# EasyEDA schematic Molten slime.json

## Sheets
1 Molten Slime all connected: TITLE: Molten Slime all connected; REV: 1.0; Date: 2025-02-14; Sheet: 1/1; Drawn By: tarasusthelight; Company: Your Company
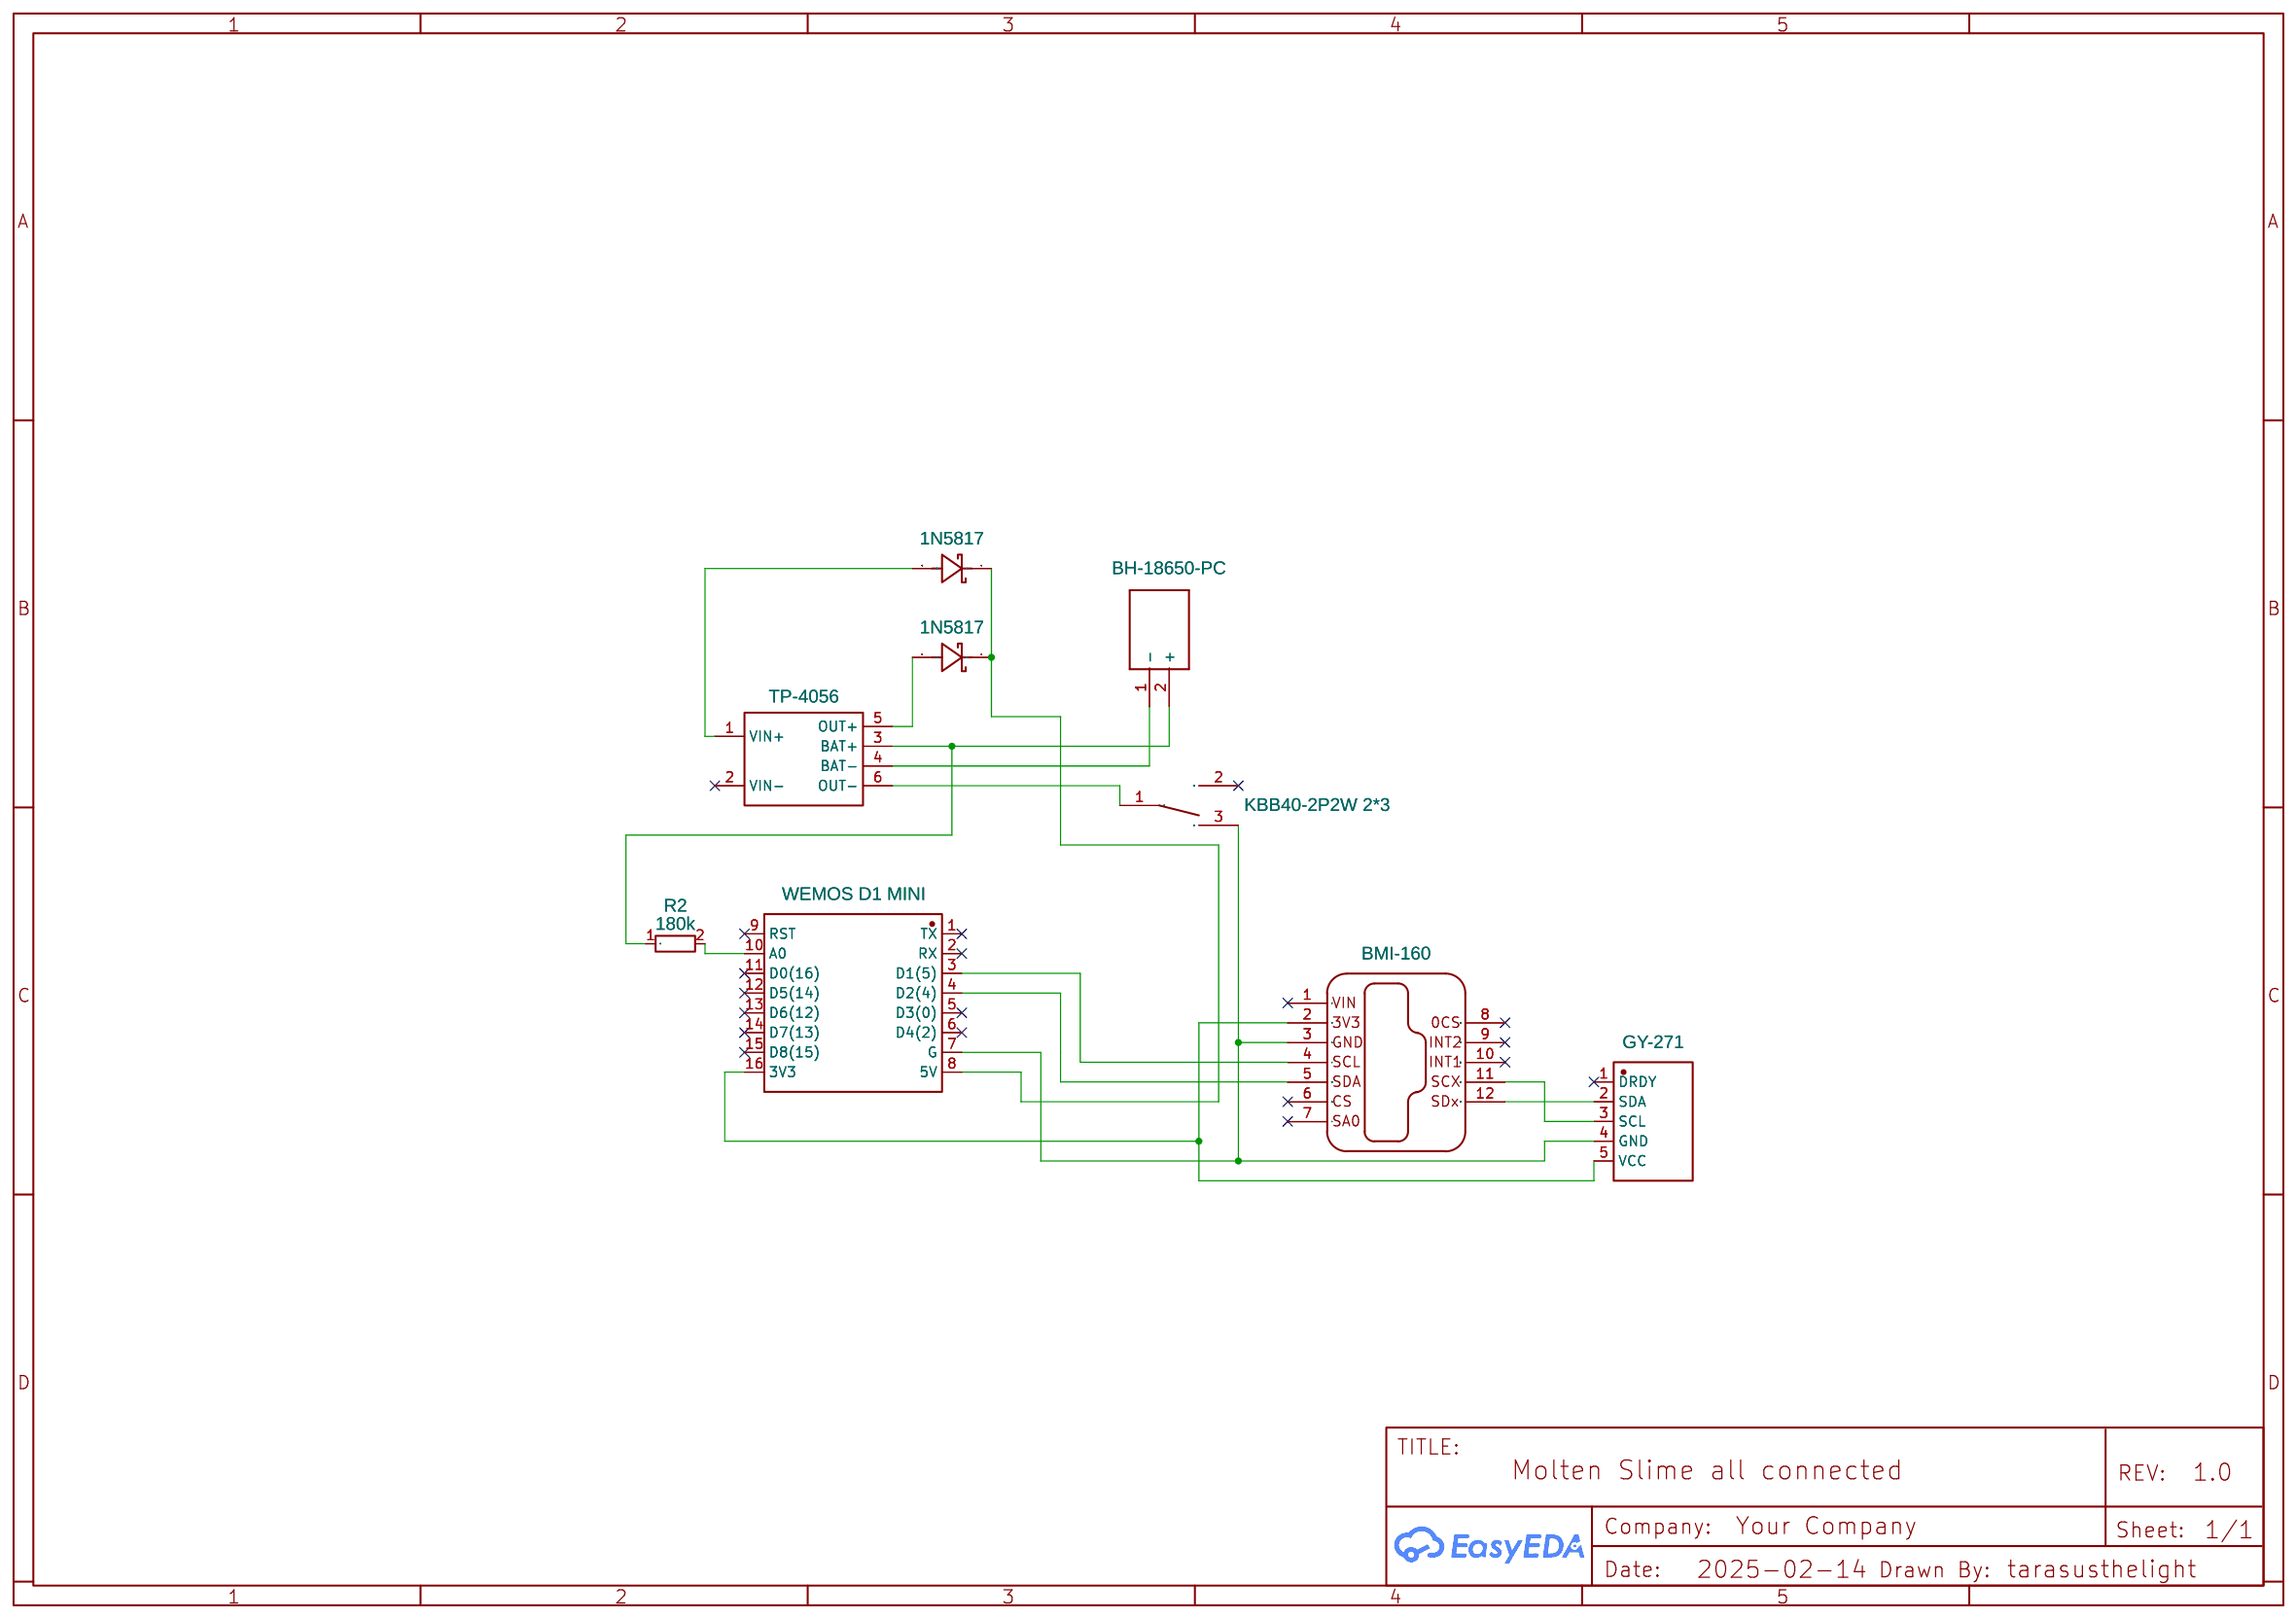
[diagram p0: Molten Slime all connected]
2 Molten Slime separated: TITLE: Molten Slime separated; Date: 2025-02-15
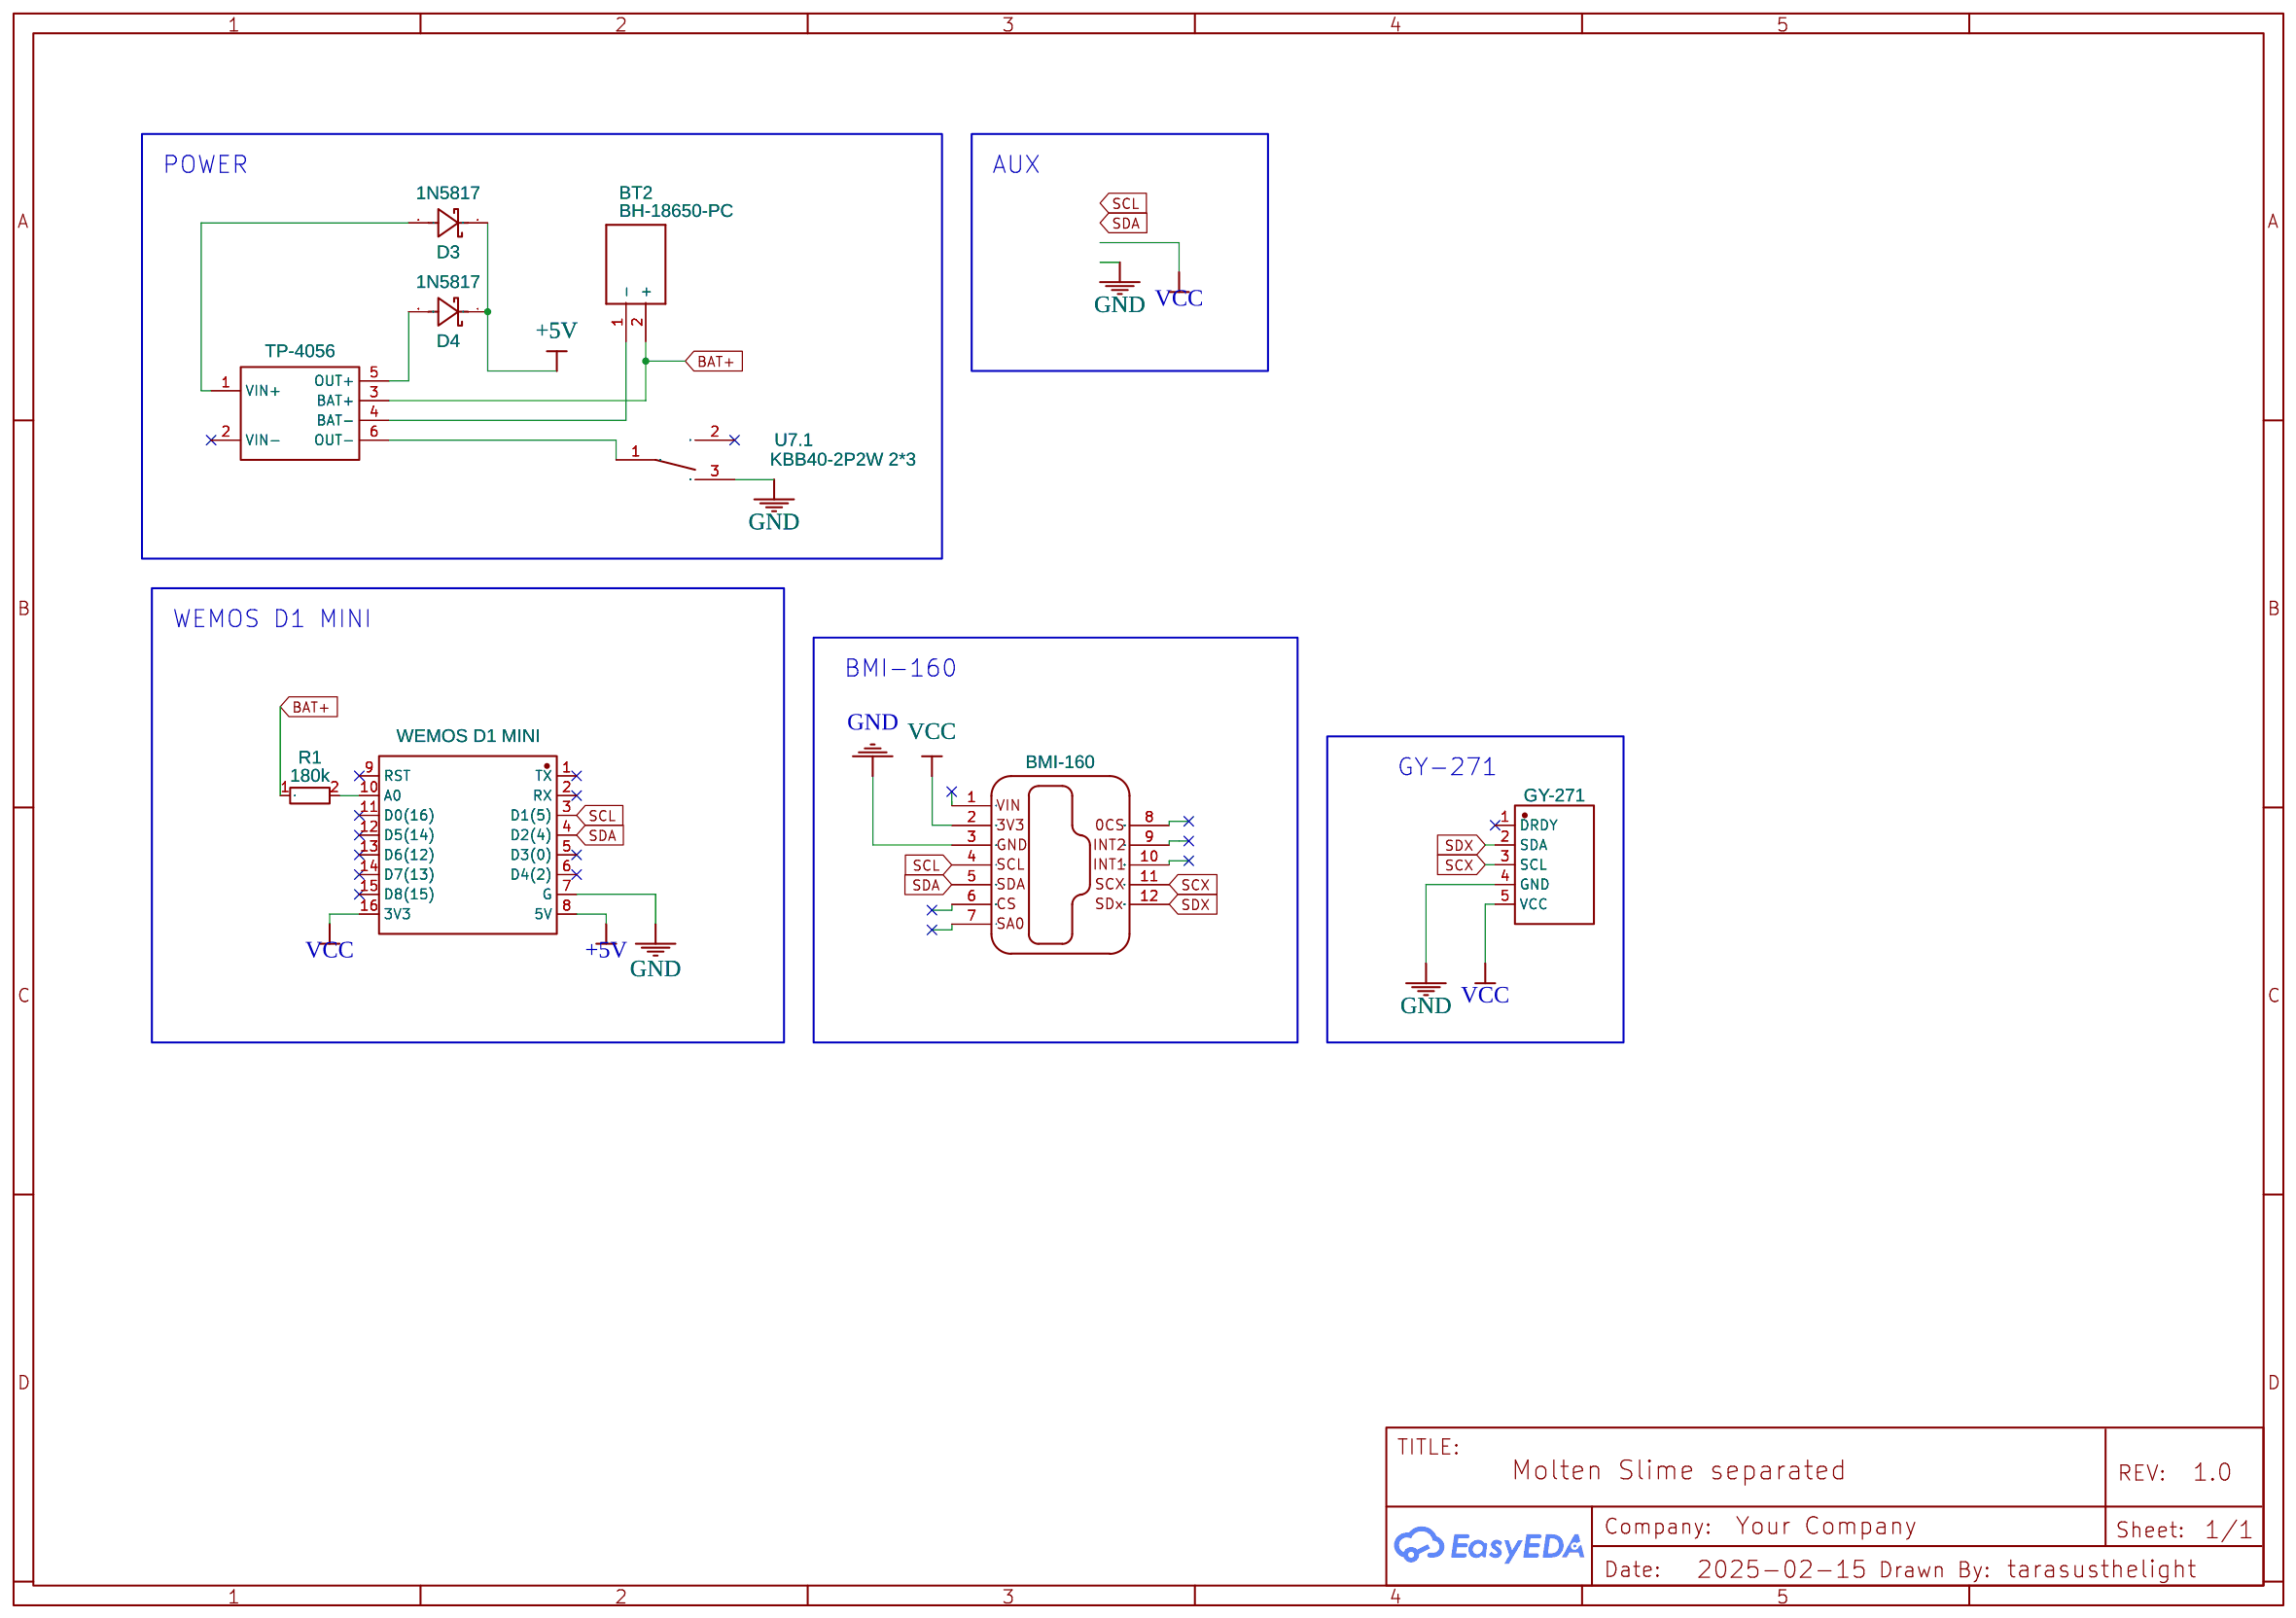
[diagram p1: Molten Slime separated]

## Parts
sheet Molten Slime all connected
A1  TP-4056  [TP-4056-HW-373-LI-ION-CHANGER]
BT1  BH-18650-PC  [BH18650PC]
D1  1N5817  [DO-41_BD2.4-L4.7-P8.70-D0.9-RD]
D2  1N5817  [DO-41_BD2.4-L4.7-P8.70-D0.9-RD]
R2  180k  [RESISTOR_THT_12,7MM]
U1  WEMOS D1 MINI  [DIP-16_WEMOS_D1_MINI_PRO4]
U3  BMI-160  [BMI-160 MODULE UNDER FOOTPRINT]
U5  GY-271  [GY-271]
U6  KBB40-2P2W 2*3  [KBB40-2P2W]  (section 1)
sheet Molten Slime separated
A2  TP-4056  [TP-4056-HW-373-LI-ION-CHANGER]
BT2  BH-18650-PC  [BH18650PC]
D3  1N5817  [DO-41_BD2.4-L4.7-P8.70-D0.9-RD]
D4  1N5817  [DO-41_BD2.4-L4.7-P8.70-D0.9-RD]
R1  180k  [RESISTOR_THT_12,7MM]
U2  WEMOS D1 MINI  [DIP-16_WEMOS_D1_MINI_PRO4]
U4  GY-271  [GY-271]
U7  KBB40-2P2W 2*3  [KBB40-2P2W]  (section 1)
U8  BMI-160  [BMI-160 MODULE UNDER FOOTPRINT]

## Library data of the parts
A1 A2 = TP-4056-HW-373-LI-ION-CHARGER: Contributor: Citisenx
BT1 BT2 = BH-18650-PC: Contributor: fepblaster
D1-D4 = 1N5817_C698892: Contributor: LCSC; Supplier: LCSC; Supplier Part: C698892; Manufacturer: YANGJIE(扬杰); JLCPCB Part Class: Extended Part
R1 R2 = 180k_1%_THT: Supplier: LCSC; Supplier Part: C172975; Manufacturer: YAGEO; Manufacturer Part: MFR-25FTE52-180K; JLCPCB Part Class: Extended Part; link: https://www.lcsc.com/datasheet/lcsc_datasheet_2304140030_YAGEO-MFR-25FTE52-150K_C172972.pdf
U1 U2 = WEMOS_D1_MINI_PRO4: Contributor: LCSC; Supplier: LCSC; Supplier Part: C2837266; Manufacturer: null; Manufacturer Part: Wemos_D1_mini_Pro4; JLCPCB Part Class: Extended Part
U3 U8 = BMI-160 Module Under Footprint: Contributor: Cocaine
U4 U5 = GY-271: Contributor: MySelf9911
U6 U7 = KBB40-2P2W 2*3: Contributor: ggenn; subpart_no: 1

## Nets
+5V: D3.1 D4.1 U2.8(5V)
GND: U2.7(G) U4.4(GND) U7.3 U8.3
VCC: U2.16(3V3) U4.5(VCC) U8.2
BAT+: A2.3(BAT+) BT2.2(+) R1.1
SCL: U2.3(D1(5)) U8.4
SCX: U4.3(SCL) U8.11
SDA: U2.4(D2(4)) U8.5
SDX: U4.2(SDA) U8.12
Net-(A1-1): A1.1(VIN+) D1.2
Net-(A1-3): A1.3(BAT+) BT1.2(+) R2.1
Net-(A1-4): A1.4(BAT-) BT1.1(-)
Net-(A1-5): A1.5(OUT+) D2.2
Net-(A1-6): A1.6(OUT-) U6.1
Net-(A2-1): A2.1(VIN+) D3.2
Net-(A2-4): A2.4(BAT-) BT2.1(-)
Net-(A2-5): A2.5(OUT+) D4.2
Net-(A2-6): A2.6(OUT-) U7.1
Net-(D1-1): D1.1 D2.1 U1.8(5V)
Net-(R1-2): R1.2 U2.10(A0)
Net-(R2-2): R2.2 U1.10(A0)
Net-(U1-3): U1.3(D1(5)) U3.4
Net-(U1-4): U1.4(D2(4)) U3.5
Net-(U1-7): U1.7(G) U3.3 U5.4(GND) U6.3
Net-(U1-16): U1.16(3V3) U3.2 U5.5(VCC)
Net-(U3-11): U3.11 U5.3(SCL)
Net-(U3-12): U3.12 U5.2(SDA)

Not connected (* = marked no-connect by the designer): A1 2(VIN-)*; A2 2(VIN-)*; U1 1(TX)* 2(RX)* 5(D3(0))* 6(D4(2))* 9(RST)* 11(D0(16))* 12(D5(14))* 13(D6(12))* 14(D7(13))* 15(D8(15))*; U2 1(TX)* 2(RX)* 5(D3(0))* 6(D4(2))* 9(RST)* 11(D0(16))* 12(D5(14))* 13(D6(12))* 14(D7(13))* 15(D8(15))*; U3 1* 6* 7* 8* 9* 10*; U4 1(DRDY)*; U5 1(DRDY)*; U6 2*; U7 2*; U8 1 6 7 8 9 10

## Notes on the sheets
sheet 2
- POWER
- AUX
- WEMOS D1 MINI
- BMI-160
- GY-271
